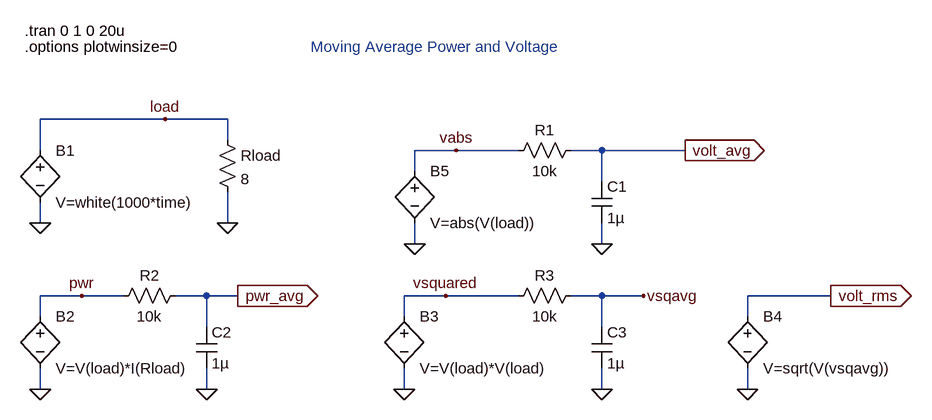
[diagram p0: schematic moving_average1.asc]
moving_average1.asc, the LTspice schematic file:
Version 4
SHEET 1 1088 680
WIRE -144 176 -336 176
WIRE -48 176 -144 176
WIRE -48 208 -48 176
WIRE -336 224 -336 176
WIRE 304 224 240 224
WIRE 400 224 304 224
WIRE 528 224 480 224
WIRE 656 224 528 224
WIRE 240 256 240 224
WIRE 528 272 528 224
WIRE -336 336 -336 304
WIRE -48 336 -48 288
WIRE 240 368 240 336
WIRE 528 368 528 336
WIRE -272 448 -336 448
WIRE -208 448 -272 448
WIRE -80 448 -128 448
WIRE -32 448 -80 448
WIRE 288 448 224 448
WIRE 400 448 288 448
WIRE 528 448 480 448
WIRE 592 448 528 448
WIRE 880 448 752 448
WIRE -336 480 -336 448
WIRE 224 480 224 448
WIRE 752 480 752 448
WIRE -80 496 -80 448
WIRE 528 496 528 448
WIRE -336 592 -336 560
WIRE -80 592 -80 560
WIRE 224 592 224 560
WIRE 528 592 528 560
WIRE 752 592 752 560
FLAG -336 336 0
FLAG 528 368 0
FLAG -80 592 0
FLAG -336 592 0
FLAG -144 176 load
FLAG -48 336 0
FLAG 656 224 volt_avg
IOPIN 656 224 Out
FLAG -32 448 pwr_avg
IOPIN -32 448 Out
FLAG -272 448 pwr
FLAG 528 592 0
FLAG 224 592 0
FLAG 880 448 volt_rms
IOPIN 880 448 Out
FLAG 288 448 vsquared
FLAG 752 592 0
FLAG 592 448 vsqavg
FLAG 240 368 0
FLAG 304 224 vabs
SYMBOL bv -336 208 R0
SYMATTR InstName B1
SYMATTR Value V=white(1000*time)
SYMBOL res 384 240 R270
WINDOW 0 32 56 VTop 0
WINDOW 3 0 56 VBottom 0
SYMATTR InstName R1
SYMATTR Value 10k
SYMBOL cap 512 272 R0
SYMATTR InstName C1
SYMATTR Value 1µ
SYMBOL res -224 464 R270
WINDOW 0 32 56 VTop 0
WINDOW 3 0 56 VBottom 0
SYMATTR InstName R2
SYMATTR Value 10k
SYMBOL cap -96 496 R0
SYMATTR InstName C2
SYMATTR Value 1µ
SYMBOL bv -336 464 R0
SYMATTR InstName B2
SYMATTR Value V=V(load)*I(Rload)
SYMBOL res -64 192 R0
SYMATTR InstName Rload
SYMATTR Value 8
SYMBOL res 384 464 R270
WINDOW 0 32 56 VTop 0
WINDOW 3 0 56 VBottom 0
SYMATTR InstName R3
SYMATTR Value 10k
SYMBOL cap 512 496 R0
SYMATTR InstName C3
SYMATTR Value 1µ
SYMBOL bv 224 464 R0
SYMATTR InstName B3
SYMATTR Value V=V(load)*V(load)
SYMBOL bv 752 464 R0
SYMATTR InstName B4
SYMATTR Value V=sqrt(V(vsqavg))
SYMBOL bv 240 240 R0
SYMATTR InstName B5
SYMATTR Value V=abs(V(load))
TEXT -360 40 Left 0 !.tran 0 1 0 20u
TEXT 80 64 Left 0 ;Moving Average Power and Voltage
TEXT -360 64 Left 0 !.options plotwinsize=0

The netlist it stands for:
* moving_average1.asc
B1 load 0 V=white(1000*time)
R1 vabs volt_avg 10k
C1 volt_avg 0 1µ
R2 pwr pwr_avg 10k
C2 pwr_avg 0 1µ
B2 pwr 0 V=V(load)*I(Rload)
Rload load 0 8
R3 vsquared vsqavg 10k
C3 vsqavg 0 1µ
B3 vsquared 0 V=V(load)*V(load)
B4 volt_rms 0 V=sqrt(V(vsqavg))
B5 vabs 0 V=abs(V(load))
.tran 0 1 0 20u
* Moving Average Power and Voltage
.options plotwinsize=0
.backanno
.end